# Altium schematic sheet 13_iMX 8X_SYSTEM.SchDoc
size A3; SheetNumber: 14; SheetTotal: 22
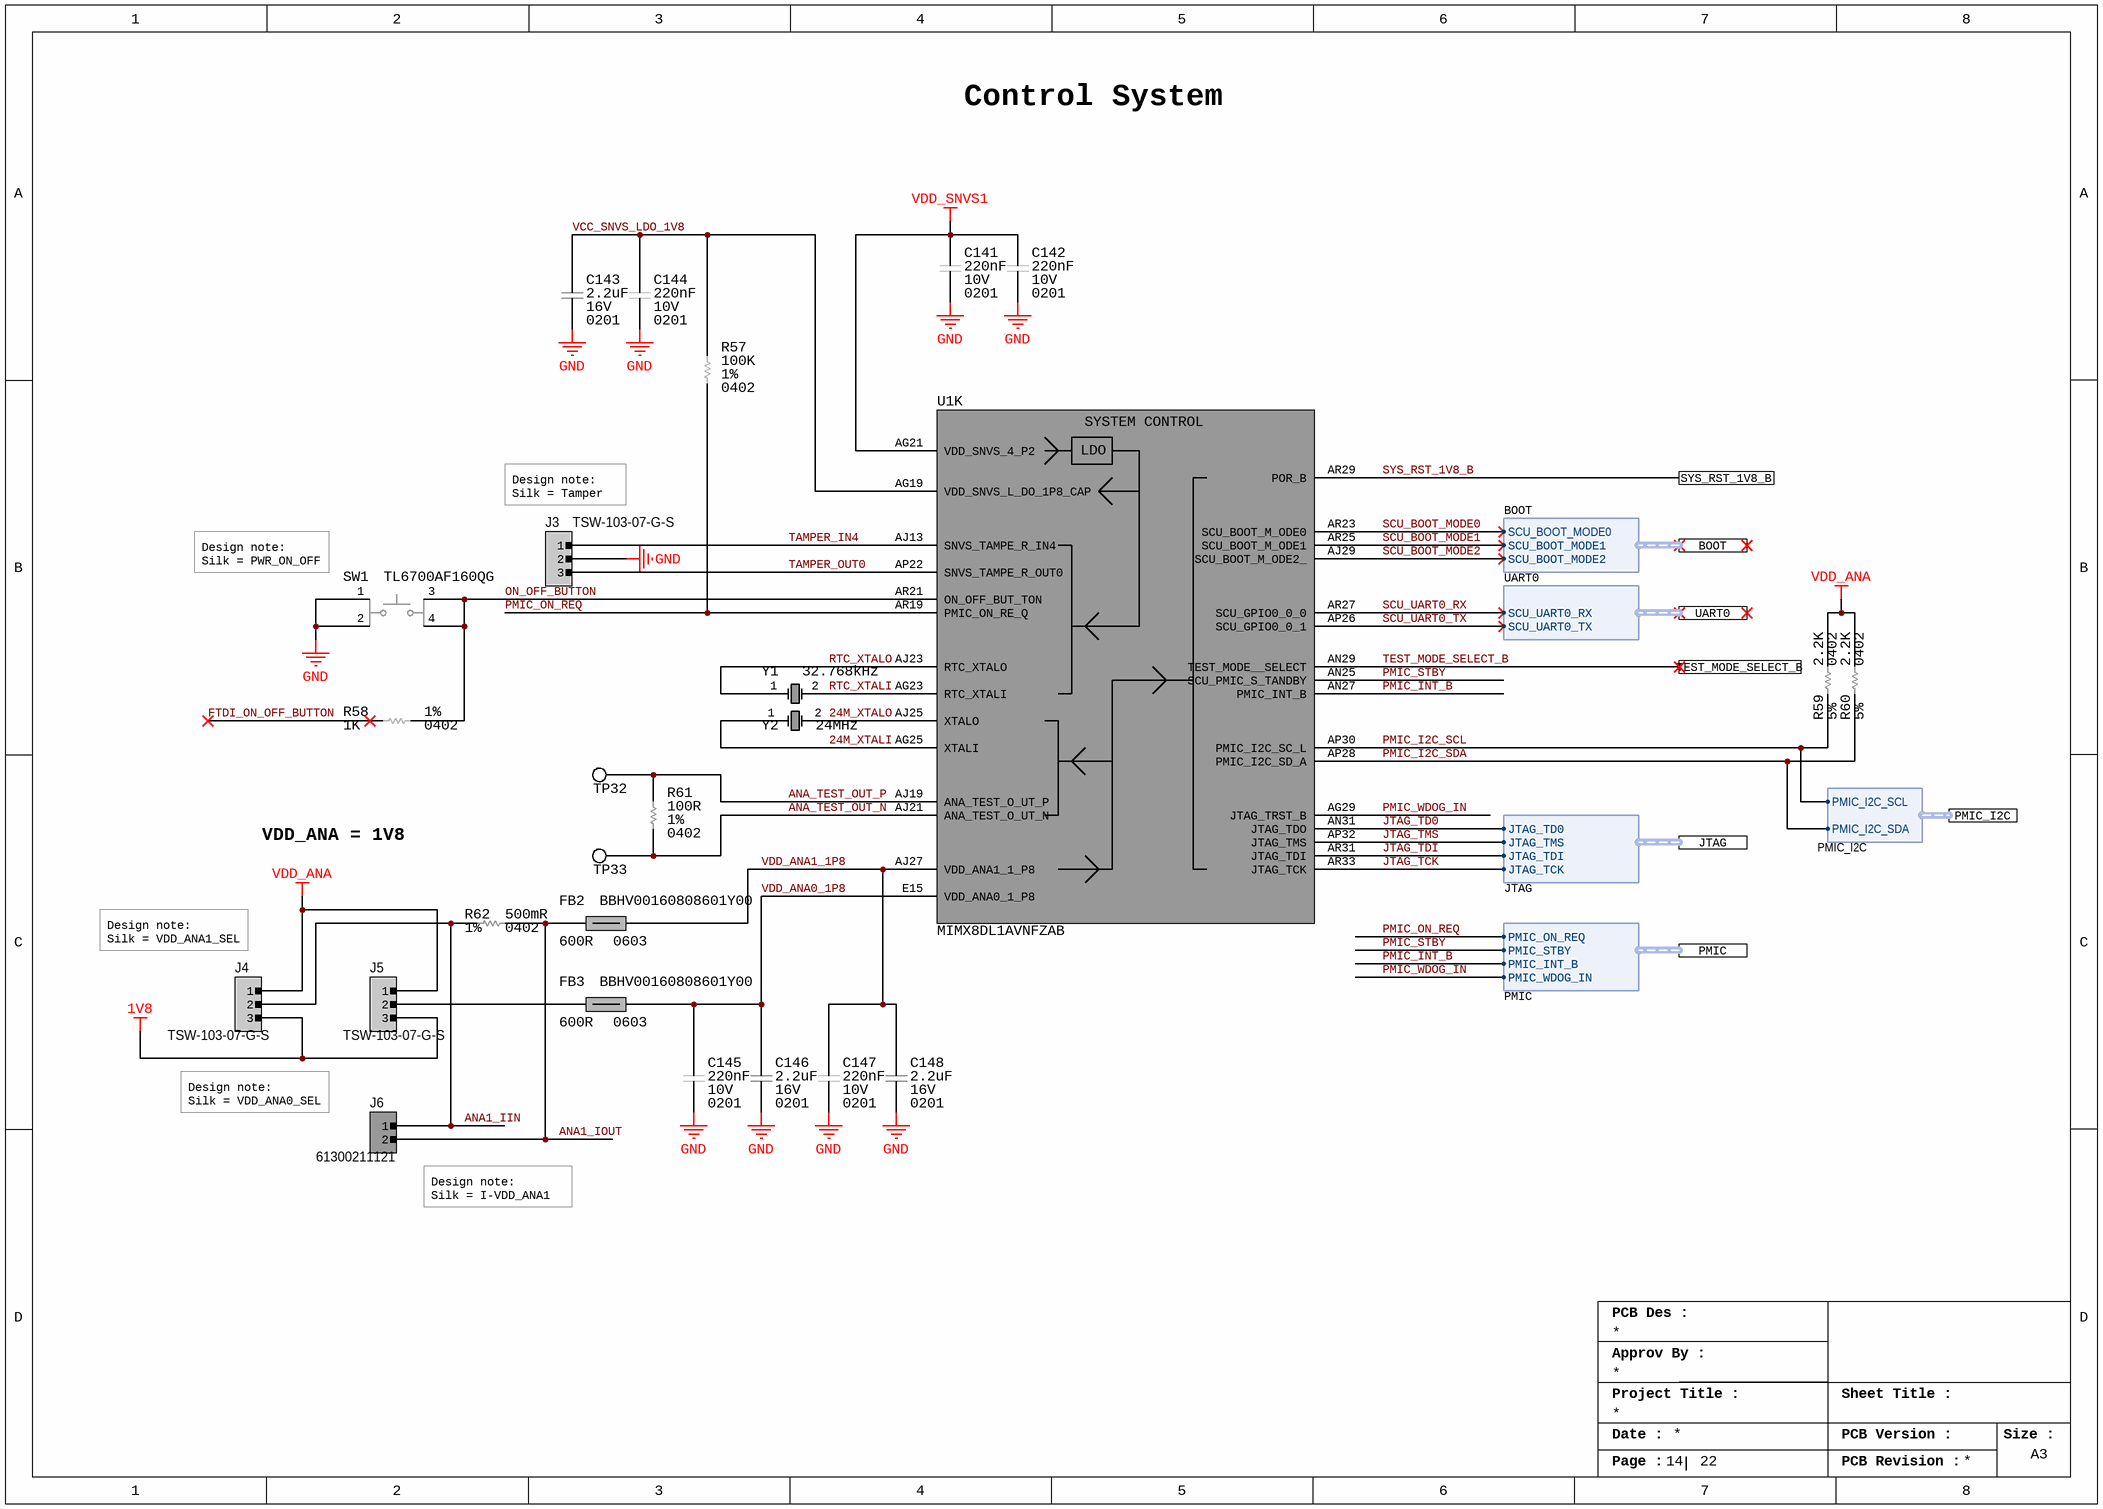
[diagram p0: 13_iMX 8X_SYSTEM.SchDoc]

## Parts
C141  Voltage Rating (DC): 10V  Capacitance: 220nF  Case/Package: 0201  [CAP_0201_CAPC0603X03N]  (hidden comment: LMK063BJ224MP-F)
C142  Voltage Rating (DC): 10V  Capacitance: 220nF  Case/Package: 0201  [CAP_0201_CAPC0603X03N]  (hidden comment: LMK063BJ224MP-F)
C143  Capacitance: 2.2uF  Voltage Rating: 16V  Case/Package: 0201  [CAP_0201_CAPC0603X03N]  (hidden comment: GRM035R61C225ME01D)
C144  Voltage Rating (DC): 10V  Capacitance: 220nF  Case/Package: 0201  [CAP_0201_CAPC0603X03N]  (hidden comment: LMK063BJ224MP-F)
C145  Voltage Rating (DC): 10V  Capacitance: 220nF  Case/Package: 0201  [CAP_0201_CAPC0603X03N]  (hidden comment: LMK063BJ224MP-F)
C146  Capacitance: 2.2uF  Voltage Rating: 16V  Case/Package: 0201  [CAP_0201_CAPC0603X03N]  (hidden comment: GRM035R61C225ME01D)
C147  Voltage Rating (DC): 10V  Capacitance: 220nF  Case/Package: 0201  [CAP_0201_CAPC0603X03N]  (hidden comment: LMK063BJ224MP-F)
C148  Capacitance: 2.2uF  Voltage Rating: 16V  Case/Package: 0201  [CAP_0201_CAPC0603X03N]  (hidden comment: GRM035R61C225ME01D)
FB2  BBHV00160808601Y00  Impedance: 600R  Case: 0603  [IND_0603_INDC1608X08N]
FB3  BBHV00160808601Y00  Impedance: 600R  Case: 0603  [IND_0603_INDC1608X08N]
J3  TSW-103-07-G-S  [CONN_HEADER_MALE_SAMTEC_TSW-103-07-G-S]
J4  TSW-103-07-G-S  [CONN_HEADER_MALE_SAMTEC_TSW-103-07-G-S]
J5  TSW-103-07-G-S  [CONN_HEADER_MALE_SAMTEC_TSW-103-07-G-S]
J6  61300211121  [HEADER_MALE_HDRV2W110P0X254_1X2_508X254X854P]
R57  Resistance: 100K  Tolerance: 1%  Case/Package: 0402  [RES_0402_RESC1005X04N]  (hidden comment: RC0402FR-07100KL)
R58  Resistance: 1K  Tolerance: 1%  Case/Package: 0402  [RES_0402_RESC1005X04N]  (hidden comment: ERJ-2RKF1001X)
R59  Tolerance: 5%  Resistance: 2.2K  Case/Package: 0402  [RES_0402_RESC1005X04N]  (hidden comment: RC0402JR-072K2L)
R60  Tolerance: 5%  Resistance: 2.2K  Case/Package: 0402  [RES_0402_RESC1005X04N]  (hidden comment: RC0402JR-072K2L)
R61  Tolerance: 1%  Resistance: 100R  Case/Package: 0402  [RES_0402_RESC1005X04N]  (hidden comment: ERJ-2RKF1000X)
R62  Case/Package: 0402  Tolerance: 1%  Resistance: 500mR  [RES_0603_RESC1608X04N]  (hidden comment: RL0402FR-070R5L)
SW1  TL6700AF160QG  [SW_TL6700AF160QG]
TP32  NO COMPONENT  [TP_PAD_0.5MM_SMD_ROUND]  (value not drawn)  (no BOM)
TP33  NO COMPONENT  [TP_PAD_0.5MM_SMD_ROUND]  (value not drawn)  (no BOM)
U1  MIMX8DL1AVNFZAB  [MIMX8DL1AVNFZAB]  (part K of 15)
Y1  Frequency: 32.768kHz  [CRYSTAL_FC135327680KAAG5]  (hidden comment: FC-135 32.7680KA-AG5)
Y2  Frequency: 24MHz  [CRYSTAL_ECS-240-18-23A-EN-TR]  (hidden comment: ECS-240-18-23A-EN-TR)

## Ports
BOOT (harness BOOT), JTAG (harness JTAG), PMIC (harness PMIC), PMIC_I2C (harness PMIC_I2C), SYS_RST_1V8_B, TEST_MODE_SELECT_B, UART0 (harness UART0)

## Harnesses
JTAG: JTAG_TD0, JTAG_TMS, JTAG_TDI, JTAG_TCK
UART0: SCU_UART0_RX, SCU_UART0_TX
BOOT: SCU_BOOT_MODE1, SCU_BOOT_MODE2, SCU_BOOT_MODE0
PMIC_I2C: PMIC_I2C_SDA, PMIC_I2C_SCL
PMIC: PMIC_ON_REQ, PMIC_STBY, PMIC_INT_B, PMIC_WDOG_IN

## Nets
1V8: J4.3 J5.3
GND: C141.1 C142.1 C143.1 C144.1 C145.1 C146.1 C147.1 C148.1 J3.2 SW1.1 SW1.2
VDD_ANA: J4.1 J5.1 R59.2 R60.2
VDD_SNVS1: C141.2 C142.2 U1.AG21(VDD_SNVS_4_P2)
24M_XTALI: U1.AG25(XTALI) Y2.1(OSC1)
24M_XTALO: U1.AJ25(XTALO) Y2.2(OSC2)
ANA1_IIN: J4.2 J6.1 R62.1
ANA1_IOUT: FB2.1 J6.2 R62.2
ANA_TEST_OUT_N: R61.1 TP33.1 U1.AJ21(ANA_TEST_O_UT_N)
ANA_TEST_OUT_P: R61.2 TP32.1 U1.AJ19(ANA_TEST_O_UT_P)
FTDI_ON_OFF_BUTTON: R58.1
JTAG_TCK: U1.AR33(JTAG_TCK) ; port JTAG.JTAG_TCK
JTAG_TD0: U1.AN31(JTAG_TDO) ; port JTAG.JTAG_TD0
JTAG_TDI: U1.AR31(JTAG_TDI) ; port JTAG.JTAG_TDI
JTAG_TMS: U1.AP32(JTAG_TMS) ; port JTAG.JTAG_TMS
ON_OFF_BUTTON: R58.2 SW1.3 SW1.4 U1.AR21(ON_OFF_BUT_TON)
PMIC_I2C_SCL: R59.1 U1.AP30(PMIC_I2C_SC_L) ; port PMIC_I2C.PMIC_I2C_SCL
PMIC_I2C_SDA: R60.1 U1.AP28(PMIC_I2C_SD_A) ; port PMIC_I2C.PMIC_I2C_SDA
PMIC_INT_B: U1.AN27(PMIC_INT_B) ; port PMIC.PMIC_INT_B
PMIC_ON_REQ: R57.1 U1.AR19(PMIC_ON_RE_Q) ; port PMIC.PMIC_ON_REQ
PMIC_STBY: U1.AN25(SCU_PMIC_S_TANDBY) ; port PMIC.PMIC_STBY
PMIC_WDOG_IN: U1.AG29(JTAG_TRST_B) ; port PMIC.PMIC_WDOG_IN
RTC_XTALI: U1.AG23(RTC_XTALI) Y1.2(OSC2)
RTC_XTALO: U1.AJ23(RTC_XTALO) Y1.1(OSC1)
SCU_BOOT_MODE0: U1.AR23(SCU_BOOT_M_ODE0) ; port BOOT.SCU_BOOT_MODE0
SCU_BOOT_MODE1: U1.AR25(SCU_BOOT_M_ODE1) ; port BOOT.SCU_BOOT_MODE1
SCU_BOOT_MODE2: U1.AJ29(SCU_BOOT_M_ODE2_) ; port BOOT.SCU_BOOT_MODE2
SCU_UART0_RX: U1.AR27(SCU_GPIO0_0_0) ; port UART0.SCU_UART0_RX
SCU_UART0_TX: U1.AP26(SCU_GPIO0_0_1) ; port UART0.SCU_UART0_TX
SYS_RST_1V8_B: U1.AR29(POR_B) ; port SYS_RST_1V8_B
TAMPER_IN4: J3.1 U1.AJ13(SNVS_TAMPE_R_IN4)
TAMPER_OUT0: J3.3 U1.AP22(SNVS_TAMPE_R_OUT0)
TEST_MODE_SELECT_B: U1.AN29(TEST_MODE__SELECT) ; port TEST_MODE_SELECT_B
VCC_SNVS_LDO_1V8: C143.2 C144.2 R57.2 U1.AG19(VDD_SNVS_L_DO_1P8_CAP)
VDD_ANA0_1P8: C145.2 C146.2 FB3.2 U1.E15(VDD_ANA0_1_P8)
VDD_ANA1_1P8: C147.2 C148.2 FB2.2 U1.AJ27(VDD_ANA1_1_P8)
NetFB3_1: FB3.1 J5.2

## Notes on the sheet
- Control System
- (near J3) Design note:
  Silk = Tamper
- (near SW1) Design note:
  Silk = PWR_ON_OFF
- VDD_ANA = 1V8
- (near J4) Design note:
  Silk = VDD_ANA1_SEL
- Design note:
  Silk = VDD_ANA0_SEL
- (near J6) Design note:
  Silk = I-VDD_ANA1
- PCB Des :
- Approv By :
- Project Title :
- Sheet Title :
- Date :
- PCB Version :
- Size :
- A3
- Page :
- PCB Revision :
- (in symbol IC_MPU_ARM_1.2GHz_MIMX8DL1AVNFZAB, part K) SYSTEM CONTROL; LDO

## Library data of the parts
C141 C142 C144 C145 C147 = CAP_0.22UF_10V_X5R_0201: Multilayer Ceramic Capacitors (High dielectric type), 10V, 0.22 uF, ± 20 %, 0201, X5R, RoHS; Manufacturer: Taiyo Yuden; Material: 4241ConductorMaterial; Tolerance: 20%; Supplier 1: Digikey; Manufacturer Part Number: LMK063BJ224MP-F; RoHS: Yes; Category: Ceramic Capacitors; Stock 1: 6053224; Pricing 1: 1=0.12, 10=0.08, 50=0.0478, 100=0.0375, 500=0.02772, 1000=0.02295, 2500=0.02136, 5000=0.01954 (USD); Mount: Surface Mount; Case Code (Metric): 0603; Case Code (Imperial): 0201; Min Operating Temperature: -55°C; Max Operating Temperature: 85°C; Voltage Rating: 10V; Packaging: Tape and Reel; Package Quantity: 15000; Dielectric: X5R; Termination: SMD/SMT; Voltage: 10V; Series: M; Construction: Flat; Length: 0.6mm; Width: 0.3mm; Height: 0.3mm; Depth: 0.3mm; Radiation Hardening: No; Halogen Free: Halogen Free; RoHS Compliant: Yes; Reach SVHC Compliant: Unknown; ComponentLink1URL: https://datasheet.ciiva.com/134/lmk063bj224mp-f-ss-134995.pdf?src-supplier=Digikey; ComponentLink1Description: https://datasheet.ciiva.com/134/lmk063bj224mp-f-ss-134995.pdf?src-supplier=Digikey; ComponentLink2URL: https://datasheet.ciiva.com/11464/lmk063bj224mp-f-ss-11464053.pdf?src-supplier=Avnet; ComponentLink2Description: https://datasheet.ciiva.com/11464/lmk063bj224mp-f-ss-11464053.pdf?src-supplier=Avnet; ComponentLink3URL: https://datasheet.ciiva.com/15921/1589lmk063bj224mp-f-15921250.pdf?src-supplier=Onlinecomponents.com; ComponentLink3Description: https://datasheet.ciiva.com/15921/1589lmk063bj224mp-f-15921250.pdf?src-supplier=Onlinecomponents.com; ComponentLink4URL: https://datasheet.ciiva.com/26872/getdatasheetpartid-639019-26872592.pdf?src-supplier=Verical; ComponentLink4Description: https://datasheet.ciiva.com/26872/getdatasheetpartid-639019-26872592.pdf?src-supplier=Verical; ComponentLink5URL: https://datasheet.ciiva.com/30243/100lmk063bj224mp-f-30243150.pdf?src-supplier=Onlinecomponents.com; ComponentLink5Description: https://datasheet.ciiva.com/30243/100lmk063bj224mp-f-30243150.pdf?src-supplier=Onlinecomponents.com; ComponentLink6URL: https://datasheet.ciiva.com/28645/746258-28645141.pdf?src-supplier=Element14; ComponentLink6Description: https://datasheet.ciiva.com/28645/746258-28645141.pdf?src-supplier=Element14; ComponentLink7URL: https://datasheet.ciiva.com/5422/mlcc-all-e-541559-5422365.pdf?src-supplier=Mouser; ComponentLink7Description: https://datasheet.ciiva.com/5422/mlcc-all-e-541559-5422365.pdf?src-supplier=Mouser; Supplier Part Number 1: 587-2483-1-ND
C143 C146 C148 = CAP_2.2uF_16V_X5R_0201: General Up to 85C Reflow soldering; Manufacturer: Murata; Material: Ceramic; Dielectric: X5R; Tolerance: 20%; Supplier 1: Digikey; Manufacturer Part Number: GRM035R61C225ME01D; RoHS: No; Category: Ceramic Capacitors; Stock 1: 18674; Pricing 1: 1=0.36, 10=0.233, 50=0.1636, 100=0.1321, 500=0.09814, 1000=0.08587, 2500=0.08178, 5000=0.07565 (USD); Min Operating Temperature: -55°C; Max Operating Temperature: 85°C; Voltage Rating (DC): 16V; Length: 600um; Width: 300um; Height: 550um; Thickness: 500um; RoHS Compliant: Yes; ComponentLink1URL: https://datasheet.octopart.com/GRM035R61C225ME01D-Murata-datasheet-165579666.pdf?src-supplier=TME; ComponentLink1Description: https://datasheet.octopart.com/GRM035R61C225ME01D-Murata-datasheet-165579666.pdf?src-supplier=TME; Supplier Part Number 1: 490-GRM035R61C225ME01DCT-ND
FB2 FB3 = IND_FERRITE_BEADS_600R_2A_BBHV00160808601Y00: Ferrite Chip Bead 600Ohm 2A 0.1Ohm Multilayer 2-Pin 0603 T/R; Manufacturer: Pulse; Supplier 1: Digi-Key; Manufacturer Part Number: BBHV00160808601Y00; RoHS: No; Category: Ferrite Beads and Chips; Stock 1: 8853; Pricing 1: 1=0.1, 10=0.064, 25=0.058, 50=0.052, 100=0.0382, 250=0.02776, 500=0.02546, 1000=0.02199 (USD); Supplier Part Number 1: 553-BBHV00160808601Y00CT-ND; Current rating: 2A
J3-J5 = CONN_HEADER_MALE_3P_2.54mm_TSW-103-07-G-S: Conn Unshrouded Header HDR 3 POS 2.54mm Solder ST Top Entry Thru-Hole Bulk; Manufacturer: Samtec; Number of Contacts: 3; Gender: Male; Max Current Rating: 7.6A; Max Voltage Rating (AC): 550V; Supplier 1: Digikey; Manufacturer Part Number: TSW-103-07-G-S; RoHS: Yes; Category: Board to Board Connectors; Stock 1: 5646; Pricing 1: 1=0.61, 10=0.494, 100=0.403, 500=0.3493, 1000=0.32848, 5000=0.28482, 10000=0.2735 (USD); Mount: Through Hole; Contact Plating: Gold; Contact Material: Bronze; Housing Color: Black; Housing Material: Polyester; Color: Black; Min Operating Temperature: -55°C; Max Operating Temperature: 125°C; Number of Rows: 1; Packaging: Bulk; Termination: Solder; Number of Positions: 3; Series: TSW; Contact Type: Male Pin; Orientation: Vertical; Package Quantity: 1; Length: 7.62mm; Pitch: 2.54mm; Depth: 2.54mm; Contact Mating Length: 0.23inch; RoHS Compliant: Yes; Lead Free: Lead Free; Reach SVHC Compliant: No; ComponentLink1URL: https://datasheet.ciiva.com/6889/tsw-xxx-xx-xxx-x-xx-xxx-mkt-6889655.pdf?src-supplier=Digikey; ComponentLink1Description: https://datasheet.ciiva.com/6889/tsw-xxx-xx-xxx-x-xx-xxx-mkt-6889655.pdf?src-supplier=Digikey; ComponentLink2URL: https://datasheet.ciiva.com/7124/tsw-th-7124622.pdf?src-supplier=Newark; ComponentLink2Description: https://datasheet.ciiva.com/7124/tsw-th-7124622.pdf?src-supplier=Newark; Supplier Part Number 1: SAM1029-03-ND
J6 = CONN_HEADER_MALE_2P_2.54_61300211121: THT Vertical Pin Header WR-PHD, Pitch 2.54 mm, Single Row, 2 pins; Manufacturer: Wurth Electronics; Current Rating: 3A; Voltage Rating: 250V; Number of Positions: 2; Gender: 29Gender; Contact Resistance: 20mR; Pitch: 0.1inch; Supplier 1: Digikey; Manufacturer Part Number: 61300211121; RoHS: Yes; Category: Headers and Wire Housings; Stock 1: 91042; Pricing 1: 1=0.13, 10=0.113, 25=0.094, 50=0.079, 100=0.071, 1000=0.065 (USD); Mount: Through Hole; Contact Plating: Gold; Housing Material: PBT; Contact Material: Copper Alloy,Copper; Color: Black; Min Operating Temperature: -40°C; Max Operating Temperature: 125°C; Number of Rows: 1; Contact Gender: Male; Packaging: Bulk; Termination: Through Hole; Number of Contacts: 2; Series: WR-PHD; Contact Type: Male Pin; Operating Supply Voltage: 250V; Orientation: Vertical; Height: 8.94mm; Contact Mating Length: 0.236inch; Lead Free: Lead Free; RoHS Compliant: Yes; Reach SVHC Compliant: Unknown; ComponentLink1URL: https://datasheet.ciiva.com/13619/6130xx11121-48870-13619345.pdf?src-supplier=Mouser; ComponentLink1Description: https://datasheet.ciiva.com/13619/6130xx11121-48870-13619345.pdf?src-supplier=Mouser; Supplier Part Number 1: 732-5315-ND
R57 = RES_100K_1%_100mW_0402: SMD Chip Resistor, 100 kOhm, ± 1%, 63 mW, 0402 [1005 Metric], Thick Film, General Purpose; Manufacturer: Yageo; Temperature Coefficient: 100ppm/°C; Power Rating: 63mW; Voltage Rating: 50V; Supplier 1: Digi-Key; Manufacturer Part Number: RC0402FR-07100KL; RoHS: Yes; Category: Chip SMD Resistors; Stock 1: 27579413; Pricing 1: 1=0.1, 10=0.014, 50=0.0084, 100=0.007, 500=0.00464, 1000=0.00396, 5000=0.00282 (USD); Case Code (Metric): 1005; Case Code (Imperial): 0402; Min Operating Temperature: -55°C; Max Operating Temperature: 155°C; Resistor Type: Thick Film; Packaging: Tape and Reel; Package Quantity: 1; Number of Terminations: 2; Termination: SMD/SMT; Max Power Dissipation: 63mW; Features: Moisture Resistant; Series: RC; Resistance Tolerance: 1%; Construction: Rectangular; Technology: THICK FILM; Voltage Rating (AC): 50V; Length: 0.039inch; Width: 0.02inch; Height: 0.016inch; Depth: 0.5mm; Reach SVHC Compliant: No; RoHS Compliant: Yes; Lead Free: 5697LeadFree; Military Standard: Not; ComponentLink1URL: https://datasheet.ciiva.com/11819/0900766b80c66297-11819452.pdf?src-supplier=Rs; ComponentLink1Description: https://datasheet.ciiva.com/11819/0900766b80c66297-11819452.pdf?src-supplier=Rs; ComponentLink2URL: https://datasheet.ciiva.com/22747/1018594-22747509.pdf?src-supplier=Element14; ComponentLink2Description: https://datasheet.ciiva.com/22747/1018594-22747509.pdf?src-supplier=Element14; ComponentLink3URL: https://datasheet.ciiva.com/2453/pyu-r-int-thick-7-2453362.pdf?src-supplier=Digi-Key; ComponentLink3Description: https://datasheet.ciiva.com/2453/pyu-r-int-thick-7-2453362.pdf?src-supplier=Digi-Key; ComponentLink4URL: https://datasheet.ciiva.com/12667/pyu-rc0402-51-rohs-l-6-r-12667930.pdf?src-supplier=Mouser; ComponentLink4Description: https://datasheet.ciiva.com/12667/pyu-rc0402-51-rohs-l-6-r-12667930.pdf?src-supplier=Mouser; ComponentLink5URL: https://datasheet.ciiva.com/15189/getdatasheetpartid-323696-15189334.pdf?src-supplier=Verical; ComponentLink5Description: https://datasheet.ciiva.com/15189/getdatasheetpartid-323696-15189334.pdf?src-supplier=Verical; ComponentLink6URL: https://datasheet.ciiva.com/2453/pyu-r-int-thick-7-2453363.pdf?src-supplier=Digi-Key; ComponentLink6Description: https://datasheet.ciiva.com/2453/pyu-r-int-thick-7-2453363.pdf?src-supplier=Digi-Key; ComponentLink7URL: https://datasheet.ciiva.com/2453/pyu-r-int-thick-7-2453361.pdf?src-supplier=Digi-Key; ComponentLink7Description: https://datasheet.ciiva.com/2453/pyu-r-int-thick-7-2453361.pdf?src-supplier=Digi-Key; Supplier Part Number 1: 311-100KLRCT-ND
R58 = RES_1K_1%_100mW_0402: RES SMD 1K OHM 1% 1/10W 0402; Manufacturer: Panasonic; Temperature Coefficient: 100ppm/°C; Max Power Dissipation: 100mW; Voltage Rating (DC): 50V; Supplier 1: Digi-Key; Manufacturer Part Number: ERJ-2RKF1001X; RoHS: Yes; Category: Chip SMD Resistors; Stock 1: 2367361; Pricing 1: 1=0.1, 10=0.029, 50=0.0162, 100=0.0119, 500=0.00728, 1000=0.00535, 5000=0.00384 (USD); Mount: Surface Mount; Number of Pins: 2; Case Code (Imperial): 0402; Case Code (Metric): 1005; Contact Plating: Tin; Min Operating Temperature: -55°C; Max Operating Temperature: 155°C; Packaging: Tape and Reel; Number of Terminations: 2; Features: Automotive AEC-Q200; Voltage Rating: 50V; Power Rating: 100mW; Package Quantity: 1; Termination: SMD/SMT; Resistor Type: Thick Film; Series: ERJ; Resistance Tolerance: 1%; Construction: Rectangular; Technology: THICK FILM; Length: 1mm; Width: 0.5mm; Height: 0.35mm; Depth: 0.5mm; Lead Free: Lead Free; RoHS Compliant: Yes; Reach SVHC Compliant: Yes; Military Standard: Not; Supplier Part Number 1: P1.00KLCT-ND
R59 R60 = RES_2.2K_5%_63mW_0402: SMD Chip Resistor, 2.2 kOhm, ± 5%, 63 mW, 0402 [1005 Metric], Thick Film, General Purpose; Manufacturer: Yageo; Power Rating: 62.5mW; Voltage Rating: 50V; Temperature Coefficient: 100ppm/°C; Max Power Dissipation: 63mW; Supplier 1: Mouser; Manufacturer Part Number: RC0402JR-072K2L; RoHS: Yes; Category: Chip SMD Resistors; Stock 1: 27488; Pricing 1: 1=0.1, 10=0.011, 50=0.011, 100=0.006, 1000=0.005, 10000=0.002 (USD); Case Code (Metric): 1005; Case Code (Imperial): 0402; Weight: 2.3E-05oz; Min Operating Temperature: -55°C; Max Operating Temperature: 155°C; Package Quantity: 1; Packaging: Tape and Reel; Resistor Type: Thick Film; Number of Terminations: 2; Termination: SMD/SMT; Working Voltage: 50V; Features: Moisture Resistant; Series: RC; Resistance Tolerance: 5%; Construction: Rectangular; Technology: THICK FILM; Voltage Rating (AC): 50V; Length: 1mm; Width: 0.02inch; Height: 0.016inch; Depth: 0.5mm; Reach SVHC Compliant: No; Military Standard: Not; RoHS Compliant: Yes; Lead Free: 5697LeadFree; ComponentLink1URL: https://datasheet.ciiva.com/2518/pyu-r-int-thick-7-2518881.pdf?src-supplier=Digikey; ComponentLink1Description: https://datasheet.ciiva.com/2518/pyu-r-int-thick-7-2518881.pdf?src-supplier=Digikey; ComponentLink2URL: https://datasheet.ciiva.com/2518/pyu-r-int-thick-7-2518882.pdf?src-supplier=Digikey; ComponentLink2Description: https://datasheet.ciiva.com/2518/pyu-r-int-thick-7-2518882.pdf?src-supplier=Digikey; ComponentLink3URL: https://datasheet.ciiva.com/2518/pyu-r-int-thick-7-2518880.pdf?src-supplier=Digikey; ComponentLink3Description: https://datasheet.ciiva.com/2518/pyu-r-int-thick-7-2518880.pdf?src-supplier=Digikey; ComponentLink4URL: https://datasheet.ciiva.com/12577/pyu-rc0402-51-rohs-l-6-r-12577433.pdf?src-supplier=Mouser; ComponentLink4Description: https://datasheet.ciiva.com/12577/pyu-rc0402-51-rohs-l-6-r-12577433.pdf?src-supplier=Mouser; ComponentLink5URL: https://datasheet.ciiva.com/7850/1018594-7850191.pdf?src-supplier=Element14; ComponentLink5Description: https://datasheet.ciiva.com/7850/1018594-7850191.pdf?src-supplier=Element14; ComponentLink6URL: https://datasheet.ciiva.com/7850/1018594-7850190.pdf?src-supplier=Element14; ComponentLink6Description: https://datasheet.ciiva.com/7850/1018594-7850190.pdf?src-supplier=Element14; ComponentLink7URL: https://datasheet.ciiva.com/16741/pyu-rc0402-51-rohs-l-6-r-16741086.pdf?src-supplier=Future+Electronics; ComponentLink7Description: https://datasheet.ciiva.com/16741/pyu-rc0402-51-rohs-l-6-r-16741086.pdf?src-supplier=Future+Electronics; ComponentLink8URL: https://datasheet.ciiva.com/15189/getdatasheetpartid-327800-15189558.pdf?src-supplier=Verical; ComponentLink8Description: https://datasheet.ciiva.com/15189/getdatasheetpartid-327800-15189558.pdf?src-supplier=Verical; Supplier Part Number 1: 603-RC0402JR-072K2L
R61 = RES_100R_1%_100mW_0402: Resistor Thick Film 0402 100 Ohm 1% 1/10W 100ppm/C Molded SMD Punched Carrier T/R; Manufacturer: Panasonic; Temperature Coefficient: 100ppm/°C; Power Rating: 100mW; Voltage Rating: 50V; Supplier 1: Mouser; Manufacturer Part Number: ERJ-2RKF1000X; RoHS: Yes; Category: Chip SMD Resistors; Stock 1: 10699571; Pricing 1: 1=0.1, 10=0.015, 50=0.015, 100=0.009, 1000=0.006, 10000=0.004 (USD); Mount: Surface Mount; Number of Pins: 2; Contact Plating: Tin; Case Code (Imperial): 0402; Case Code (Metric): 1005; Size Code: 0402; Min Operating Temperature: -55°C; Max Operating Temperature: 155°C; Resistor Type: Thick Film; Packaging: Tape and Reel; Package Quantity: 1; Termination: SMD/SMT; Number of Terminations: 2; Max Power Dissipation: 100mW; Voltage Rating (DC): 50V; Features: Automotive AEC-Q200; Series: ERJ; Technology: THICK FILM; Resistance Tolerance: 1%; Construction: Rectangular; Length: 1mm; Width: 0.5mm; Height: 0.35mm; Depth: 0.5mm; Radiation Hardening: No; Reach SVHC Compliant: No; Military Standard: Not; Lead Free: Lead Free; RoHS Compliant: Yes; ComponentLink1URL: https://datasheet.ciiva.com/27056/2007311-27056035.pdf?src-supplier=Jameco; ComponentLink1Description: https://datasheet.ciiva.com/27056/2007311-27056035.pdf?src-supplier=Jameco; ComponentLink2URL: https://datasheet.ciiva.com/11821/0900766b80f80784-11821173.pdf?src-supplier=Rs; ComponentLink2Description: https://datasheet.ciiva.com/11821/0900766b80f80784-11821173.pdf?src-supplier=Rs; ComponentLink3URL: https://datasheet.ciiva.com/7830/426256-7830973.pdf?src-supplier=Element14; ComponentLink3Description: https://datasheet.ciiva.com/7830/426256-7830973.pdf?src-supplier=Element14; ComponentLink4URL: https://datasheet.ciiva.com/43467/1678782-43467223.pdf?src-supplier=Farnell; ComponentLink4Description: https://datasheet.ciiva.com/43467/1678782-43467223.pdf?src-supplier=Farnell; ComponentLink5URL: https://datasheet.ciiva.com/28514/1678782-28514175.pdf?src-supplier=Element14; ComponentLink5Description: https://datasheet.ciiva.com/28514/1678782-28514175.pdf?src-supplier=Element14; ComponentLink6URL: https://datasheet.ciiva.com/46372/1678782-46372741.pdf?src-supplier=Element14; ComponentLink6Description: https://datasheet.ciiva.com/46372/1678782-46372741.pdf?src-supplier=Element14; ComponentLink7URL: https://datasheet.ciiva.com/16776/70260748-16776427.pdf?src-supplier=Allied+Electronics; ComponentLink7Description: https://datasheet.ciiva.com/16776/70260748-16776427.pdf?src-supplier=Allied+Electronics; ComponentLink8URL: https://datasheet.ciiva.com/9186/aoa0000ce2-9186683.pdf?src-supplier=Avnet; ComponentLink8Description: https://datasheet.ciiva.com/9186/aoa0000ce2-9186683.pdf?src-supplier=Avnet; ComponentLink9URL: https://datasheet.ciiva.com/16199/aoa0000ce2-16199575.pdf?src-supplier=Future+Electronics; ComponentLink9Description: https://datasheet.ciiva.com/16199/aoa0000ce2-16199575.pdf?src-supplier=Future+Electronics; ComponentLink10URL: https://datasheet.ciiva.com/48531/aoa0000ce2-48531067.pdf?src-supplier=Avnet; ComponentLink10Description: https://datasheet.ciiva.com/48531/aoa0000ce2-48531067.pdf?src-supplier=Avnet; ComponentLink11URL: https://datasheet.ciiva.com/30260/aoa0000ce2-30260809.pdf?src-supplier=Onlinecomponents.com; ComponentLink11Description: https://datasheet.ciiva.com/30260/aoa0000ce2-30260809.pdf?src-supplier=Onlinecomponents.com; Supplier Part Number 1: 667-ERJ-2RKF1000X
R62 = RES_0.5R_63mW_0402: SMD Current Sense Resistor, 0.5 ohm, RL Series, 0402 [1005 Metric], 63 mW, ï¿½ 1%, Thick Film; Manufacturer: Yageo; Power Rating: 62.5mW; Voltage Rating: 100V; Temperature Coefficient: 300ppm/°C; Max Power Dissipation: 63mW; Supplier 1: Digikey; Manufacturer Part Number: RL0402FR-070R5L; RoHS: Yes; Category: Chip SMD Resistors; Stock 1: 28460; Pricing 1: 1=0.22, 10=0.097, 100=0.0704, 1000=0.05916, 2500=0.0561 (USD); Case Code (Imperial): 0402; Case Code (Metric): 1005; Min Operating Temperature: -55°C; Max Operating Temperature: 155°C; Packaging: Tape and Reel; Termination: SMD/SMT; Features: Moisture Resistant,Automotive AEC-Q200; Series: RL; Number of Terminations: 2; Lead Free: Lead Free; RoHS Compliant: Yes; ComponentLink1URL: http://www.mouser.com/ds/2/447/PYu-RL_521_RoHS_L_5-2927.pdf?src-supplier=Mouser; ComponentLink1Description: http://www.mouser.com/ds/2/447/PYu-RL_521_RoHS_L_5-2927.pdf?src-supplier=Mouser; ComponentLink2URL: http://www.yageo.com/exep/pages/download/literatures/R-chip_current%20sensor_20140512.pdf?src-supplier=Digikey; ComponentLink2Description: http://www.yageo.com/exep/pages/download/literatures/R-chip_current%20sensor_20140512.pdf?src-supplier=Digikey; ComponentLink3URL: http://www.yageo.com/documents/recent/PYu-RL_Group_521_RoHS_L_2.pdf?src-supplier=Digikey; ComponentLink3Description: http://www.yageo.com/documents/recent/PYu-RL_Group_521_RoHS_L_2.pdf?src-supplier=Digikey; ComponentLink4URL: https://datasheet.octopart.com/RL0402FR-070R5L-Yageo-datasheet-83209227.pdf?src-supplier=Future+Electronics; ComponentLink4Description: https://datasheet.octopart.com/RL0402FR-070R5L-Yageo-datasheet-83209227.pdf?src-supplier=Future+Electronics; Supplier Part Number 1: 311-.5PCT-ND
SW1 = SWITCH_SPST_TL6700AF160QG: TL6700 Series SPST 1.6 N Round Button Gull Wing SMT Sealed Tactile Switch; Manufacturer: E-Switch; Mechanical Life: 500000Cycles; Actuator Material: Rubber; Operating Force: 160gf; Voltage Rating (DC): 12V; Contact Resistance: 100mR; Current Rating: 50mA; Illumination Type: Non-Illuminated,Illuminated; Switch Travel: 0.35mm; Switch Function: Off-Mom; Actuator Type: Standard; Supplier 1: Digikey; Manufacturer Part Number: TL6700AF160QG; RoHS: Yes; Category: Tactile Switches; Stock 1: 25465; Pricing 1: 1=0.86, 10=0.739, 25=0.6872, 100=0.613, 250=0.5678, 500=0.53634, 1400=0.42022, 2800=0.39904, 4200=0.3877, 7000=0.3775 (USD); Mount: Surface Mount; Case/Package: SMD/SMT; Contact Material: Silver; Contact Plating: Silver; Min Operating Temperature: -20°C; Max Operating Temperature: 70°C; Package Quantity: 1400; Packaging: Tape and Reel; Throw Configuration: SPST; Max Voltage Rating (DC): 12V; Termination: Gull Wing; Electrical Life: 500000Cycles; Orientation: Straight; Series: TL6700; Size: 6.2mm; Reach SVHC Compliant: No; Lead Free: Lead Free; RoHS Compliant: Yes; ComponentLink1URL: https://datasheet.ciiva.com/2901/p010463b-2901091.pdf?src-supplier=Digikey; ComponentLink1Description: https://datasheet.ciiva.com/2901/p010463b-2901091.pdf?src-supplier=Digikey; ComponentLink2URL: https://datasheet.ciiva.com/7637/tl6700-7637673.pdf?src-supplier=Element14; ComponentLink2Description: https://datasheet.ciiva.com/7637/tl6700-7637673.pdf?src-supplier=Element14; ComponentLink3URL: https://datasheet.ciiva.com/16379/tl6700-16379828.pdf?src-supplier=Future+Electronics; ComponentLink3Description: https://datasheet.ciiva.com/16379/tl6700-16379828.pdf?src-supplier=Future+Electronics; ComponentLink4URL: https://datasheet.ciiva.com/2901/p010463-2901092.pdf?src-supplier=Digikey; ComponentLink4Description: https://datasheet.ciiva.com/2901/p010463-2901092.pdf?src-supplier=Digikey; ComponentLink5URL: https://datasheet.ciiva.com/2901/p010463-2901093.pdf?src-supplier=Digikey; ComponentLink5Description: https://datasheet.ciiva.com/2901/p010463-2901093.pdf?src-supplier=Digikey; ComponentLink6URL: https://datasheet.ciiva.com/16156/tl6700-16156378.pdf?src-supplier=Onlinecomponents.com; ComponentLink6Description: https://datasheet.ciiva.com/16156/tl6700-16156378.pdf?src-supplier=Onlinecomponents.com; Supplier Part Number 1: EG4385CT-ND
TP32 TP33 = TP_PAD_SMD_SMALL: Test Point, SMD pad, round, 1.5mm, 1.6mm, 3mm diameter
U1 = IC_MPU_ARM_1.2GHz_MIMX8DL1AVNFZAB: I.MX8 Dxl 15SQ / Tray Rohs Compliant: Yes; Manufacturer: NXP Semiconductors; Supplier 1: Mouser; Manufacturer Part Number: MIMX8DL1AVNFZAB; RoHS: No; Category: Uncategorized; Stock 1: 196; Pricing 1: 1=46.19, 10=40.26, 25=38.57, 50=38.56, 100=33.3, 252=33.16, 1000=33.3, 10000=33.3 (USD); Supplier Part Number 1: 771-MIMX8DL1AVNFZAB
Y1 = CRYSTAL_EPSON_32.768KHZ: Crystal 0.032768MHz ±20ppm (Tol) 7pF FUND 70000Ohm 2-Pin SMD T/R; Manufacturer: Epson; ESR (Equivalent Series Resistance): 70kR; Supplier 1: Digi-Key; Manufacturer Part Number: FC-135 32.7680KA-AG5; RoHS: Yes; Category: Crystals; Stock 1: 220593; Pricing 1: 1=0.61, 10=0.505, 50=0.4544, 100=0.404, 500=0.3838, 1000=0.3232 (USD); Mount: Surface Mount; Case/Package: SMD/SMT; Min Operating Temperature: -40°C; Max Operating Temperature: 85°C; Packaging: Tape and Reel; Load Capacitance: 7pF; Frequency Tolerance: 20ppm; Series: FC-135; Length: 0.126inch; Width: 0.061inch; Height: 0.035inch; RoHS Compliant: Yes; ComponentLink1URL: https://support.epson.biz/td/api/doc_check.php?dl=brief_FC-135&amp;lang=en&src-supplier=Digi-Key; ComponentLink1Description: https://support.epson.biz/td/api/doc_check.php?dl=brief_FC-135&amp;lang=en&src-supplier=Digi-Key; ComponentLink2URL: https://support.epson.biz/td/api/doc_check.php?dl=brief_FC-135R_en.pdf&src-supplier=Digi-Key; ComponentLink2Description: https://support.epson.biz/td/api/doc_check.php?dl=brief_FC-135R_en.pdf&src-supplier=Digi-Key; ComponentLink3URL: https://datasheet.octopart.com/FC-135-32.7680KA-AG5-Epson-datasheet-140567380.pdf?src-supplier=Arrow.cn; ComponentLink3Description: https://datasheet.octopart.com/FC-135-32.7680KA-AG5-Epson-datasheet-140567380.pdf?src-supplier=Arrow.cn; Supplier Part Number 1: SER4271CT-ND
Y2 = CRYSTAL_ECS_24MHZ: Crystal 24MHz ±30ppm (Tol) ±50ppm (Stability) 18pF FUND 30Ohm 2-Pin Mini-SMD T/R; Manufacturer: ECS International; ESR (Equivalent Series Resistance): 40R; Manufacturer Part Number: ECS-240-18-23A-EN-TR; RoHS: Yes; Category: Crystals; Stock 1: 32996; Pricing 1: 1=1.14000, 10=1.08600, 50=1.06040, 100=0.90900, 500=0.88376 (USD); Mount: Surface Mount; Case/Package: SMD/SMT; Min Operating Temperature: -40°C; Max Operating Temperature: 85°C; Package Quantity: 1; Load Capacitance: 18pF; Packaging: Tape and Reel; Frequency Tolerance: 30ppm; Frequency Stability: 50ppm; Termination: SMD/SMT; Series: ECX-64A; Length: 0.236inch; Width: 0.138inch; Height: 0.043inch; ComponentLink1URL: https://datasheet.ciiva.com/860/ecx-64a-ecx-64cr-860829.pdf?src-supplier=Digi-Key; ComponentLink1Description: https://datasheet.ciiva.com/860/ecx-64a-ecx-64cr-860829.pdf?src-supplier=Digi-Key; ComponentLink2URL: https://datasheet.ciiva.com/860/ecx-64a-ecx-64cr-860830.pdf?src-supplier=Digi-Key; ComponentLink2Description: https://datasheet.ciiva.com/860/ecx-64a-ecx-64cr-860830.pdf?src-supplier=Digi-Key; ComponentLink3URL: https://datasheet.ciiva.com/860/ecx-64a-ecx-64cr-860831.pdf?src-supplier=Digi-Key; ComponentLink3Description: https://datasheet.ciiva.com/860/ecx-64a-ecx-64cr-860831.pdf?src-supplier=Digi-Key; Supplier 1: Digi-Key; Supplier 2: Mouser; Supplier 3: Avnet; Supplier Part Number 1: XC1669CT-ND; Supplier Part Number 2: 520-240-18-23A-EN; Supplier Part Number 3: ECS-240-18-23A-EN-TR